# EAGLE design Adapterplatine (EAGLE 9.6.2)
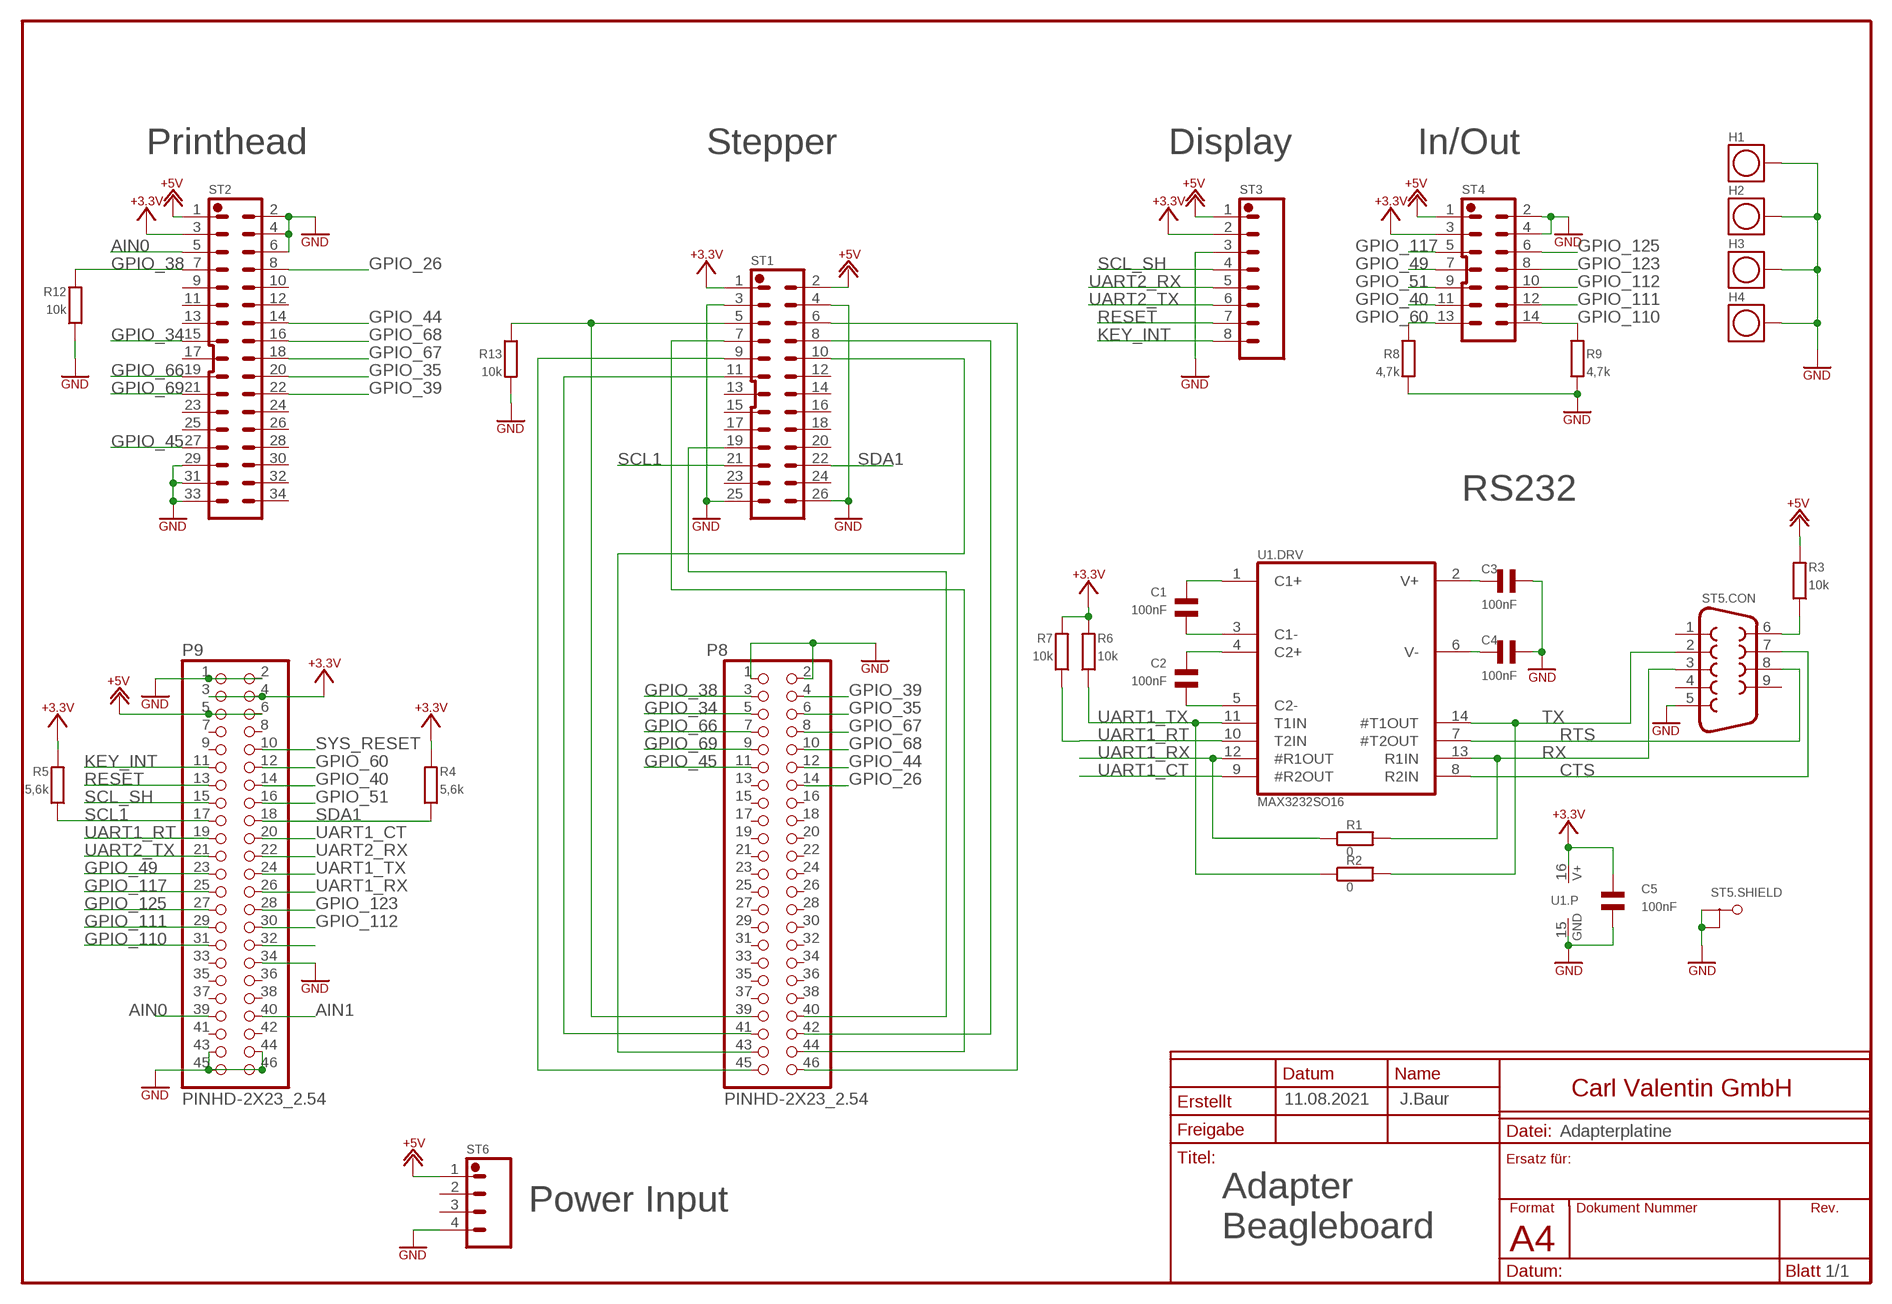
[diagram p0: schematic, sheet 1]

## Parts
C1  100nF  C0603L  [0603L]
C2  100nF  C0603L  [0603L]
C3  100nF  C0603L  [0603L]
C4  100nF  C0603L  [0603L]
C5  100nF  C0603L  [0603L]
H1  HALTERUNG_SQUAREHALTERUNG_SQUARE_6.5_3.5  [HALTERUNG_SQUARE_6.5_3.5]
H2  HALTERUNG_SQUAREHALTERUNG_SQUARE_6.5_3.5  [HALTERUNG_SQUARE_6.5_3.5]
H3  HALTERUNG_SQUAREHALTERUNG_SQUARE_6.5_3.5  [HALTERUNG_SQUARE_6.5_3.5]
H4  HALTERUNG_SQUAREHALTERUNG_SQUARE_6.5_3.5  [HALTERUNG_SQUARE_6.5_3.5]
P8  PINHD-2X23_2.54  [2X23]
P9  PINHD-2X23_2.54  [2X23]
R1  0  R0603L  [0603L]
R2  0  R0603L  [0603L]
R3  10k  R0603L  [0603L]
R4  5,6k  R0603L  [0603L]
R5  5,6k  R0603L  [0603L]
R6  10k  R0603L  [0603L]
R7  10k  R0603L  [0603L]
R8  4,7k  R0603L  [0603L]
R9  4,7k  R0603L  [0603L]
R12  10k  R0603L  [0603L]
R13  10k  R0603L  [0603L]
ST1  STK-26-2RJST-PHD_26_TH  [JST-PHD_26_TH]
ST2  STK-34-2R-MJST-PHD_34_TH-D1.0  [JST-PHD_34_TH-D1.0]
ST3  STK-08-1RJST-PH_8_TH  [JST-PH_8_TH]
ST4  STK-14-2RJST-PHD_14_TH  [JST-PHD_14_TH]
ST5  STK-09-SUBD-FSTK-09-SUBD-F-WSI  [STK-09-SUBD-F-WSI]
ST6  STK-04-1RJST-VH_4_TH  [JST-VH_4_TH]
U1  MAX3232SO16  [SO16]

## Nets
+3.3V: C5.P$2 P9.3 P9.4 R4.P$2 R5.P$2 R6.P$2 R7.P$2 ST1.1 ST2.3 ST3.2 ST4.3 U1.16(.P:V+)
+5V: P9.5 P9.6 R3.P$2 ST1.2 ST2.1 ST3.1 ST4.1 ST6.1
AIN0: P9.39 ST2.5
AIN1: P9.40
CTS: ST5.7 U1.8(.DRV:R2IN)
GND: C3.P$1 C4.P$2 C5.P$1 H1.P$1 H2.P$1 H3.P$1 H4.P$1 P8.1 P8.2 P9.1 P9.2 P9.34 P9.43 P9.44 P9.45 P9.46 R8.P$1 R9.P$1 R12.P$1 R13.P$2 ST1.3 ST1.4 ST1.25 ST1.26 ST2.2 ST2.4 ST2.6 ST2.29 ST2.31 ST2.33 ST3.3 ST4.2 ST4.4 ST5.5 ST5.G1(.SHIELD:S1) ST5.G2(.SHIELD:S2) ST6.4 U1.15(.P:GND)
GPIO_26: P8.14 ST2.8
GPIO_34: P8.5 ST2.15
GPIO_35: P8.6 ST2.20
GPIO_38: P8.3 R12.P$2 ST2.7
GPIO_39: P8.4 ST2.22
GPIO_40: P9.14 ST4.11
GPIO_44: P8.12 ST2.14
GPIO_45: P8.11 ST2.27
GPIO_49: P9.23 ST4.7
GPIO_51: P9.16 ST4.9
GPIO_60: P9.12 R8.P$2 ST4.13
GPIO_66: P8.7 ST2.19
GPIO_67: P8.8 ST2.18
GPIO_68: P8.10 ST2.16
GPIO_69: P8.9 ST2.21
GPIO_110: P9.31 R9.P$2 ST4.14
GPIO_111: P9.29 ST4.12
GPIO_112: P9.30 ST4.10
GPIO_117: P9.25 ST4.5
GPIO_123: P9.28 ST4.8
GPIO_125: P9.27 ST4.6
KEY_INT: P9.11 ST3.8
N$1: P8.46 ST1.6
N$2: P8.44 ST1.7
N$3: P8.42 ST1.8
N$4: P8.45 ST1.9
N$5: P8.43 ST1.10
N$6: P8.41 ST1.11
N$7: P8.39 R13.P$1 ST1.5
N$8: P8.40 ST1.19
N$9: P9.32
N$10: R3.P$1 ST5.6
N$21: C3.P$2 U1.2(.DRV:V+)
N$22: C4.P$1 U1.6(.DRV:V-)
N$23: C1.P$2 U1.1(.DRV:C1+)
N$24: C1.P$1 U1.3(.DRV:C1-)
N$25: C2.P$2 U1.4(.DRV:C2+)
N$26: C2.P$1 U1.5(.DRV:C2-)
RESET: P9.13 ST3.7
RTS: ST5.8 U1.7(.DRV:#T2OUT)
RX: R1.P$2 ST5.3 U1.13(.DRV:R1IN)
SCL1: P9.17 R5.P$1 ST1.21
SCL_SH: P9.15 ST3.4
SDA1: P9.18 R4.P$1 ST1.22
SYS_RESET: P9.10
TX: R2.P$2 ST5.2 U1.14(.DRV:#T1OUT)
UART1_CT: P9.20 U1.9(.DRV:#R2OUT)
UART1_RT: P9.19 R7.P$1 U1.10(.DRV:T2IN)
UART1_RX: P9.26 R1.P$1 U1.12(.DRV:#R1OUT)
UART1_TX: P9.24 R2.P$1 R6.P$1 U1.11(.DRV:T1IN)
UART2_RX: P9.22 ST3.5
UART2_TX: P9.21 ST3.6
Unconnected: P8.13 P8.15 P8.16 P8.17 P8.18 P8.19 P8.20 P8.21 P8.22 P8.23 P8.24 P8.25 P8.26 P8.27 P8.28 P8.29 P8.30 P8.31 P8.32 P8.33 P8.34 P8.35 P8.36 P8.37 P8.38 P9.7 P9.8 P9.9 P9.33 P9.35 P9.36 P9.37 P9.38 P9.41 P9.42 ST1.12 ST1.13 ST1.14 ST1.15 ST1.16 ST1.17 ST1.18 ST1.20 ST1.23 ST1.24 ST2.9 ST2.10 ST2.11 ST2.12 ST2.13 ST2.17 ST2.23 ST2.24 ST2.25 ST2.26 ST2.28 ST2.30 ST2.32 ST2.34 ST5.1 ST5.4 ST5.9 ST6.2 ST6.3

## Notes on the sheet
- Printhead | Stepper | Display | In/Out
- RS232
- 11.08.2021 | J.Baur
- Power Input
- Adapter
  Beagleboard

## Library data of the parts
C1-C5 = CV_Std:C
H1-H4 = CV_Board:HALTERUNG_SQUARE: Board-Befestigung; STUECKLISTE: 0
P8 P9 = pinhead-2:PINHD-2X23: PIN HEADER
R1-R9 R12 R13 = CV_Std:R
ST1 = CV_Con:STK-26-2R
ST2 = CV_Con:STK-34-2R-M
ST3 = CV_Con:STK-08-1R
ST4 = CV_Con:STK-14-2R
ST5 = CV_Con:STK-09-SUBD-F: Sub-D Female
ST6 = CV_Con:STK-04-1R
U1 = CV_Logic:MAX3232

## Board
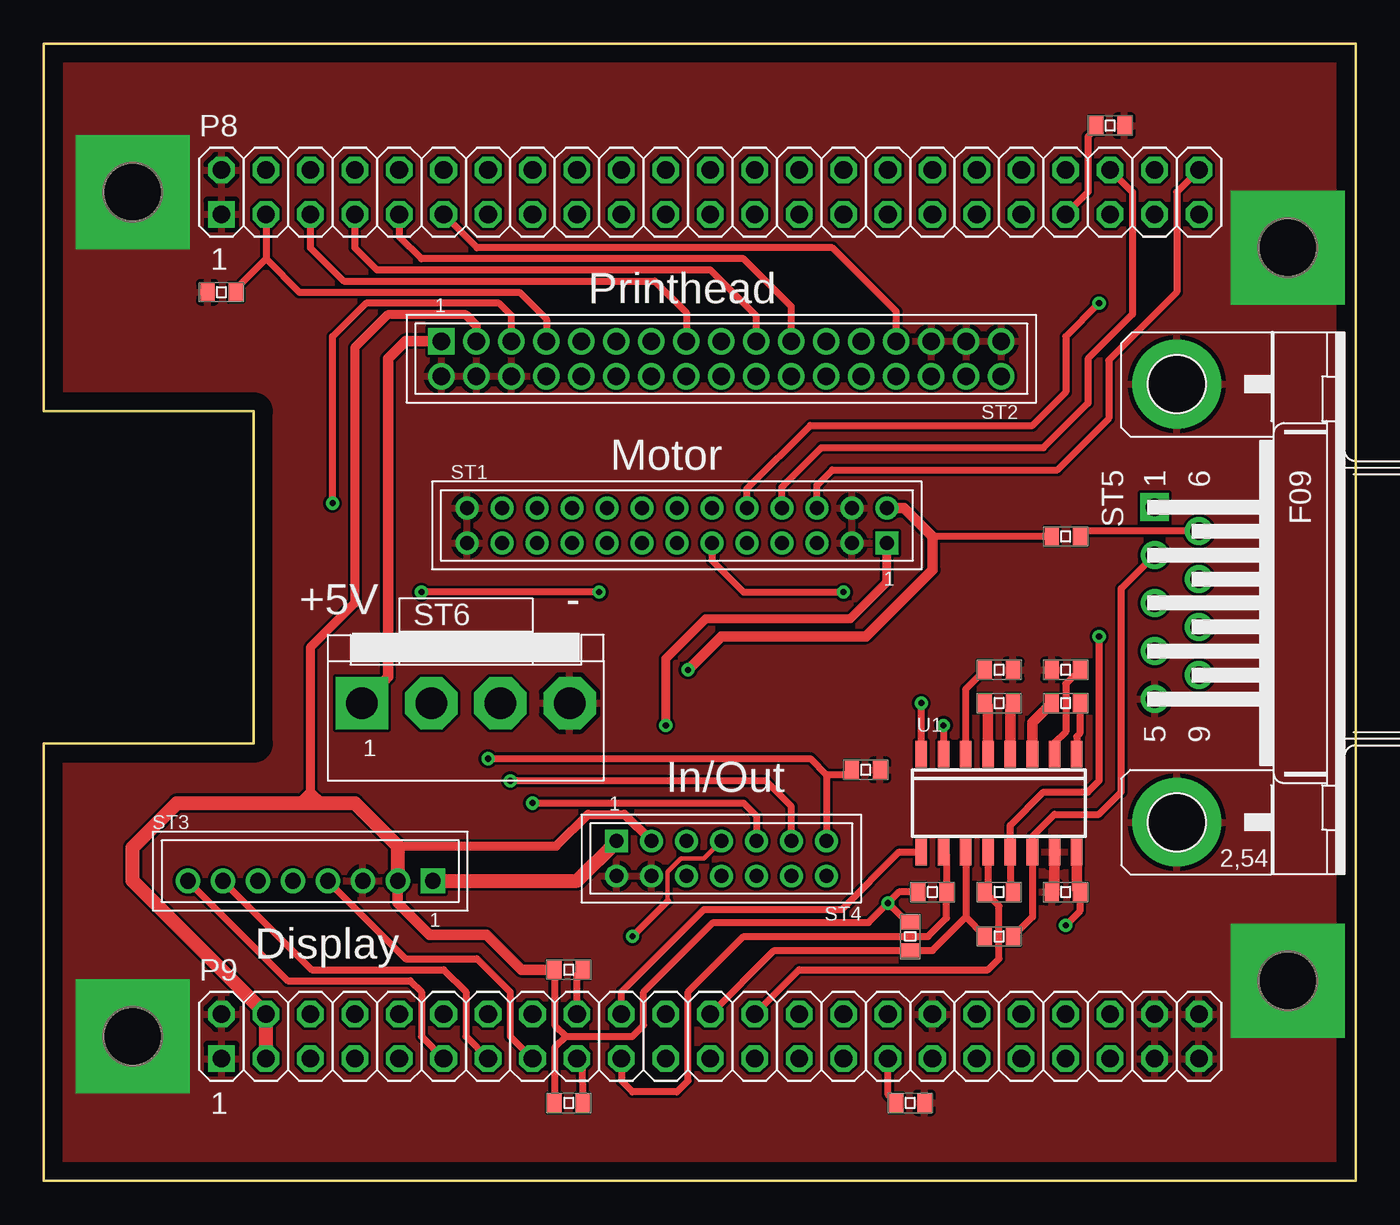
[diagram p1: board, top side]
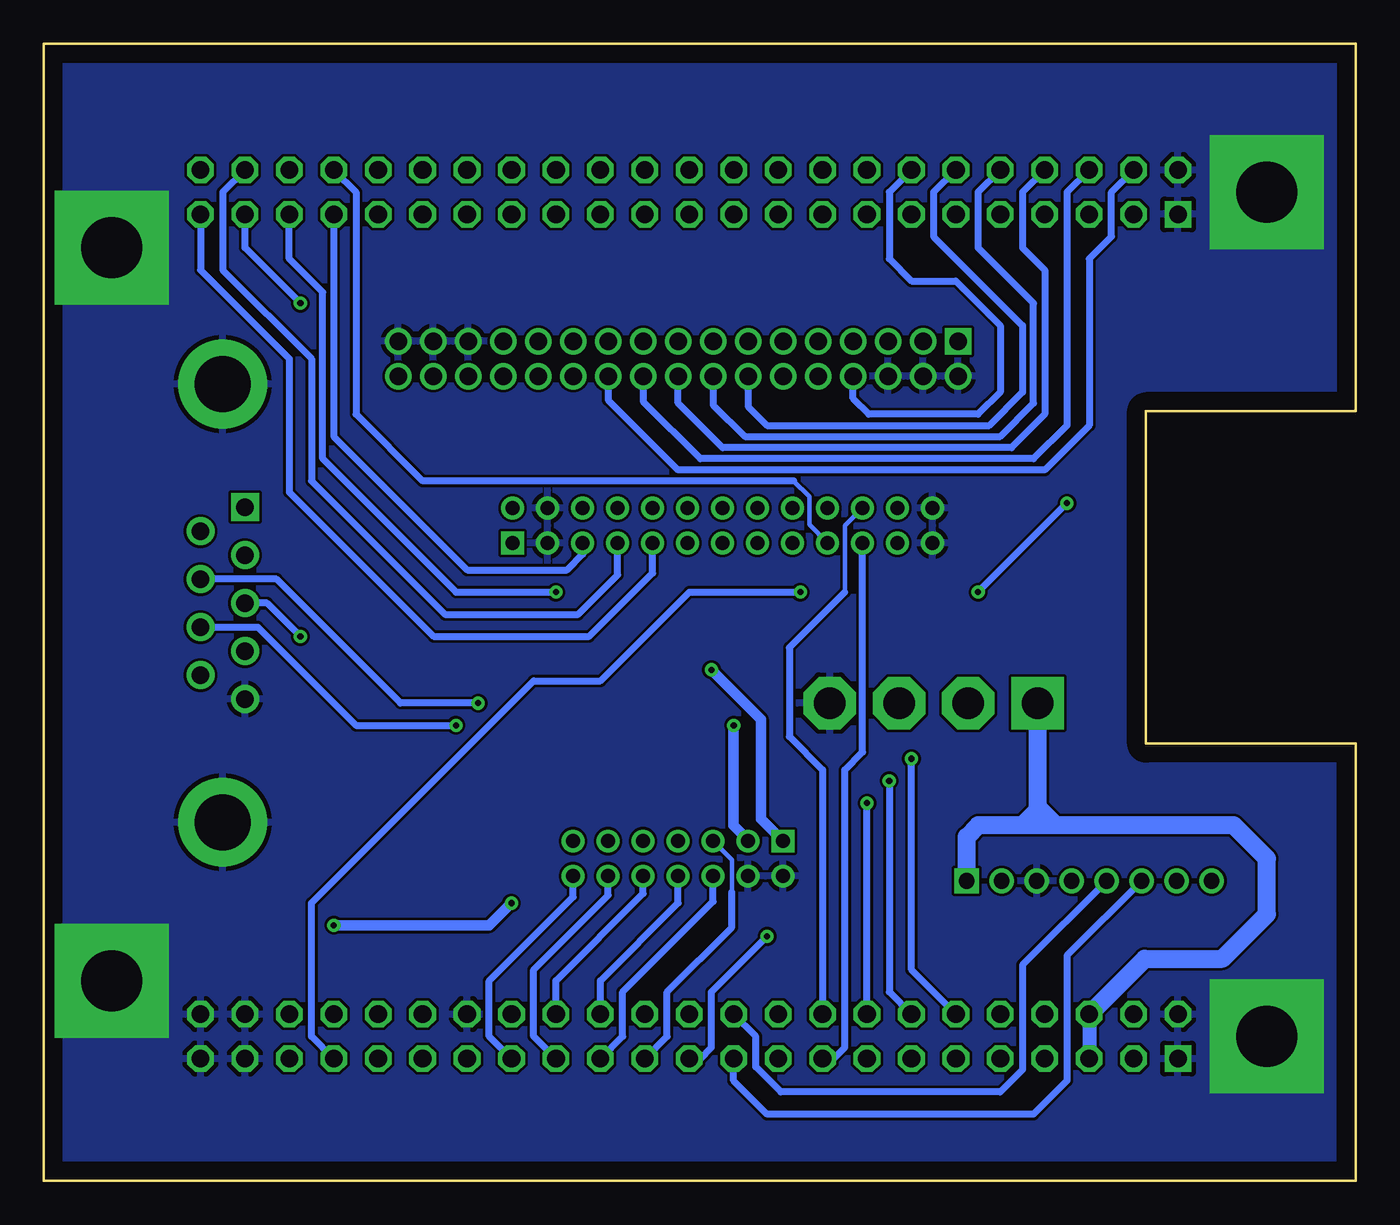
[diagram p2: board, bottom side, seen from below]

Size 75 x 65 mm. Coordinates in mm from the lower left corner, seen from the top.
Outline: 0,0 75,0 75,65 0,65 0,44 12,44 12,25 0,25 0,0
Copper layers (1*16): Top 0.035mm / dielectric 1.5mm / Bottom 0.035mm
Design rules "default *": minimum track width 6mil, minimum drill 0.35mm, track to track 6mil, track to pad 6mil, pad to pad 6mil, via to via 6mil, smd to smd 6mil, copper to edge 40mil, drill to drill 6mil, minimum pad ring 10mil, minimum via ring 8mil, stop-mask expansion 4mil, vias tented up to drill 0mil, thermal gap 10mil

### Footprints (pad centres in the part's own frame; a part is rotated, then mirrored left to right if it is on the bottom)
0603L = smd 0.8 x 1: P$1 -0.8,0; P$2 0.8,0
HALTERUNG_SQUARE_6.5_3.5 = drill 3.5 pad 6.5 square: P$1 0,0
2X23 = drill 1.016 square: 1 -25.4,-1.27 | drill 1.016 octagon: 2 -25.4,1.27; 3 -22.86,-1.27; 4 -22.86,1.27; 5 -20.32,-1.27; 6 -20.32,1.27; 7 -17.78,-1.27; 8 -17.78,1.27; 9 -15.24,-1.27; 10 -15.24,1.27; 11 -12.7,-1.27; 12 -12.7,1.27; 13 -10.16,-1.27; 14 -10.16,1.27; 15 -7.62,-1.27; 16 -7.62,1.27; 17 -5.08,-1.27; 18 -5.08,1.27; 19 -2.54,-1.27; 20 -2.54,1.27; 21 0,-1.27; 22 0,1.27; 23 2.54,-1.27; 24 2.54,1.27; 25 5.08,-1.27; 26 5.08,1.27; 27 7.62,-1.27; 28 7.62,1.27; 29 10.16,-1.27; 30 10.16,1.27; 31 12.7,-1.27; 32 12.7,1.27; 33 15.24,-1.27; 34 15.24,1.27; 35 17.78,-1.27; 36 17.78,1.27; 37 20.32,-1.27; 38 20.32,1.27; 39 22.86,-1.27; 40 22.86,1.27; 41 25.4,-1.27; 42 25.4,1.27; 43 27.94,-1.27; 44 27.94,1.27; 45 30.48,-1.27; 46 30.48,1.27
JST-PHD_26_TH = drill 0.8 square: 1 12,-1 | drill 0.8: 2 12,1; 3 10,-1; 4 10,1; 5 8,-1; 6 8,1; 7 6,-1; 8 6,1; 9 4,-1; 10 4,1; 11 2,-1; 12 2,1; 13 0,-1; 14 0,1; 15 -2,-1; 16 -2,1; 17 -4,-1; 18 -4,1; 19 -6,-1; 20 -6,1; 21 -8,-1; 22 -8,1; 23 -10,-1; 24 -10,1; 25 -12,-1; 26 -12,1
JST-PHD_34_TH-D1.0 = drill 1 square: 1 16,-1 | drill 1: 2 16,1; 3 14,-1; 4 14,1; 5 12,-1; 6 12,1; 7 10,-1; 8 10,1; 9 8,-1; 10 8,1; 11 6,-1; 12 6,1; 13 4,-1; 14 4,1; 15 2,-1; 16 2,1; 17 0,-1; 18 0,1; 19 -2,-1; 20 -2,1; 21 -4,-1; 22 -4,1; 23 -6,-1; 24 -6,1; 25 -8,-1; 26 -8,1; 27 -10,-1; 28 -10,1; 29 -12,-1; 30 -12,1; 31 -14,-1; 32 -14,1; 33 -16,-1; 34 -16,1
JST-PH_8_TH = drill 0.9 square: 1 7,0 | drill 0.9: 2 5,0; 3 3,0; 4 1,0; 5 -1,0; 6 -3,0; 7 -5,0; 8 -7,0
JST-PHD_14_TH = drill 0.8 square: 1 6,-1 | drill 0.8: 2 6,1; 3 4,-1; 4 4,1; 5 2,-1; 6 2,1; 7 0,-1; 8 0,1; 9 -2,-1; 10 -2,1; 11 -4,-1; 12 -4,1; 13 -6,-1; 14 -6,1
STK-09-SUBD-F-WSI = drill 1 pad 1.6 square: 1 -5.486,-1.27 | drill 1 pad 1.6: 2 -2.743,-1.27; 3 0,-1.27; 4 2.743,-1.27; 5 5.486,-1.27; 6 -4.115,1.27; 7 -1.372,1.27; 8 1.372,1.27; 9 4.115,1.27 | drill 3.2 pad 5.08: G1 -12.522,0; G2 12.522,0
JST-VH_4_TH = drill 1.8 pad 3 square: 1 -5.94,0 | drill 1.8 pad 3 octagon: 2 -1.98,0; 3 1.98,0; 4 5.94,0
SO16 = smd 0.66 x 1.524: 1 -4.445,-2.803; 2 -3.175,-2.803; 3 -1.905,-2.803; 4 -0.635,-2.803; 5 0.635,-2.803; 6 1.905,-2.803; 7 3.175,-2.803; 8 4.445,-2.803; 9 4.445,2.803; 10 3.175,2.803; 11 1.905,2.803; 12 0.635,2.803; 13 -0.635,2.803; 14 -1.905,2.803; 15 -3.175,2.803; 16 -4.445,2.803

### Placement (x,y rotation side)
C1  58.42,27.3 0 top
C2  54.61,27.3 0 top
C3  58.42,29.21 0 top
C4  54.61,29.21 0 top
C5  58.42,16.51 0 top
H1  5.08,56.52 0 top
H2  71.12,53.34 0 top
H3  71.12,11.43 0 top
H4  5.08,8.26 0 top
P8  35.56,56.52 0 top
P9  35.56,8.26 0 top
R1  54.61,16.51 0 top
R2  54.61,13.97 0 top
R3  58.42,36.83 180 top
R4  30.01,12.06 180 top
R5  30.01,4.45 180 top
R6  49.53,13.97 90 top
R7  50.8,16.51 180 top
R8  46.99,23.5 180 top
R9  49.53,4.45 180 top
R12  10.16,50.8 0 top
R13  60.96,60.33 0 top
ST1  36.2,37.47 0 top
ST2  38.73,46.99 180 top
ST3  15.24,17.14 0 top
ST4  38.73,18.41 180 top
ST5  64.77,33.02 270 top
ST6  24.13,27.3 0 top
U1  54.61,21.59 180 top

### Tracks (layer width: path | path; a pad name or v marks a point on that pad's centre or on a via)
+3.3V  (via drill 0.35)
  Top 0.406: R4.P$2 29.21,8.89 29.84,8.26 | 29.84,8.26 29.21,7.62 R5.P$2 | 29.84,8.26 33.66,8.26 34.29,8.89 34.29,10.79 38.27,14.77 47.16,14.77 v48.26,15.88 | C5.P$2 59.22,15.4 v58.42,14.61 | v48.26,15.88 48.9,16.51 R7.P$2 | R6.P$2 49.37,14.77 v48.26,15.88
  Top 0.508: ST2.3 24.73,48.9 24.13,49.51 19.66,49.51 17.78,47.62 17.78,33.02 15.24,30.48 15.24,22.23 | 15.88,21.59 15.24,22.23 | 15.24,22.23 14.61,21.59 | 20.24,19.13 29.29,19.13 31.11,20.95 33.2,20.95 ST4.3 | v35.56,26.04 35.56,29.84 37.85,32.13 46.1,32.13 48.2,34.23 ST1.1
  Top 0.61: C5.P$2 59.05,16.68 U1.16 | ST3.2 20.24,15.88 22.07,14.05 25.32,14.05 27.3,12.06 R4.P$2
  Top 0.813: P9.3 P9.4 5.08,17.14 5.08,19.05 7.62,21.59 14.61,21.59 15.88,21.59 17.78,21.59 20.24,19.13 ST3.2
  Bottom 0.61: v58.42,14.61 49.53,14.61 v48.26,15.88 | ST4.3 34.73,19.5 35.56,20.32 v35.56,26.04
+5V  (via drill 0.35)
  Top 0.406: R3.P$2 50.8,36.83
  Top 0.61: ST2.1 20.68,47.99 19.68,46.99 19.68,28.8 ST6.1 | v36.83,29.21 38.73,31.11 46.99,31.11 50.8,34.92 50.8,36.83 49.16,38.47 ST1.2
  Top 0.813: ST4.1 32.73,19.39 30.5,17.14 ST3.1
  Bottom 0.61: ST4.1 34.01,20.68 34.01,26.39 v36.83,29.21
  Bottom 0.813: 18.19,21.18 18,21.18 | P9.6 P9.5
  Bottom 1.016: P9.6 12.06,12.7 7.62,12.7 5.08,15.24 5.08,18.41 6.99,20.32 17.14,20.32 | ST3.1 22.24,19.67 21.59,20.32 19.05,20.32 | 17.14,20.32 19.05,20.32 | ST6.1 18.19,21.18 19.05,20.32 | 18,21.18 17.14,20.32
AIN0  (via drill 0.35)
  Top 0.406: ST2.5 26.73,49.47 26.04,50.16 18.41,50.16 16.51,48.26 v16.51,38.73 | v31.75,33.66 v21.59,33.66
  Bottom 0.406: P9.39 59.69,8.26 59.69,15.88 46.99,28.57 43.18,28.57 38.1,33.66 v31.75,33.66 | v21.59,33.66 v16.51,38.73
CTS  (via drill 0.35)
  Top 0.406: U1.8 v50.16,27.3
  Bottom 0.406: ST5.7 61.7,34.39 54.61,27.3 v50.16,27.3
GND
  Top 0.61: U1.15 57.78,16.68 C5.P$1
  pour Top: -1.91,65.41 -1.91,-1.27 76.2,-1.27 76.2,65.41
  pour Bottom: -0.64,65.41 -0.64,-1.27 76.2,-1.27 76.2,65.41
GPIO_26
  Bottom 0.406: P8.14 26.67,56.52 26.67,52.7 25.4,51.44 22.86,51.44 20.32,48.9 20.32,45.09 21.59,43.81 27.83,43.81 28.73,44.72 ST2.8
GPIO_34
  Top 0.406: P8.5 15.24,53.34 17.14,51.44 34.92,51.44 36.73,49.62 ST2.15
GPIO_35
  Bottom 0.406: P8.6 16.51,56.52 16.51,43.18 18.41,41.27 37.47,41.27 40.73,44.55 ST2.20
GPIO_38
  Top 0.406: P8.3 12.7,52.7 | ST2.7 28.73,49.26 27.2,50.8 14.61,50.8 12.7,52.7 | R12.P$2 10.96,50.97 12.7,52.7
GPIO_39
  Bottom 0.406: ST2.22 42.73,44.64 38.73,40.64 17.78,40.64 15.24,43.18 15.24,52.7 13.97,53.98 13.97,56.52 P8.4
GPIO_40  (via drill 0.35)
  Top 0.406: ST4.11 42.73,21.4 41.27,22.86 40.01,22.86 v26.67,22.86
  Bottom 0.406: v26.67,22.86 26.67,10.79 P9.14
GPIO_44
  Bottom 0.406: P8.12 24.13,56.52 24.13,53.98 19.05,48.9 19.05,45.09 20.95,43.18 33.66,43.18 34.73,44.26 ST2.14
GPIO_45
  Top 0.406: P8.11 24.77,53.34 45.09,53.34 48.73,49.69 ST2.27
GPIO_49  (via drill 0.35)
  Top 0.254: ST4.7 37.73,18.41 36.41,18.41 35.67,17.67 35.67,15.98
  Top 0.406: v33.66,13.97 35.56,15.88 35.67,15.98
  Bottom 0.406: P9.23 37.47,6.99 36.83,7.62 36.83,10.79 v33.66,13.97
GPIO_51  (via drill 0.35)
  Top 0.406: v27.94,21.59 40.01,21.59 40.73,20.86 ST4.9
  Bottom 0.406: P9.16 v27.94,21.59
GPIO_60  (via drill 0.35)
  Top 0.406: v25.4,24.13 43.81,24.13 44.73,23.21 | 44.73,23.21 ST4.13 | R8.P$2 45.91,23.21 45.09,23.21 | 45.09,23.21 44.73,23.21 | 45.09,23.21
  Bottom 0.406: P9.12 25.4,12.06 v25.4,24.13
GPIO_66
  Top 0.406: P8.7 17.78,53.34 19.05,52.07 38.1,52.07 40.73,49.44 ST2.19
GPIO_67
  Bottom 0.406: ST2.18 38.73,44.45 36.2,41.91 19.68,41.91 17.78,43.81 17.78,52.07 19.05,53.34 19.05,56.52 P8.8
GPIO_68
  Bottom 0.406: ST2.16 36.73,44.35 34.92,42.55 20.32,42.55 18.41,44.45 18.41,50.16 21.59,53.34 21.59,56.52 P8.10
GPIO_69
  Top 0.406: P8.9 20.32,53.98 21.59,52.7 40.01,52.7 42.73,49.98 ST2.21
GPIO_110
  Top 0.406: R9.P$2 48.26,4.92 P9.31
  Bottom 0.406: P9.31 49.53,8.26 49.53,11.43 44.73,16.23 ST4.14
GPIO_111
  Bottom 0.406: P9.29 46.99,8.26 46.99,12.06 42.73,16.32 ST4.12
GPIO_112
  Bottom 0.406: P9.30 45.72,11.43 40.73,16.41 ST4.10
GPIO_117
  Bottom 0.254: ST4.5 35.67,18.35 35.67,16.51
  Bottom 0.406: P9.25 39.37,8.26 39.37,10.79 35.67,14.5 35.67,16.51
GPIO_123
  Bottom 0.406: P9.28 43.18,11.43 38.73,15.88 ST4.8
GPIO_125
  Bottom 0.406: P9.27 41.91,8.26 41.91,10.79 36.73,15.97 ST4.6
KEY_INT
  Top 0.406: ST3.8 13.96,11.43 20.95,11.43 21.59,10.79 21.59,8.26 P9.11
N$1
  Top 0.406: P8.46 64.77,56.52 64.77,50.8 60.88,46.91 60.88,43.58 57.94,40.64 45.09,40.64 44.2,39.75 ST1.6
N$2
  Bottom 0.406: P8.44 64.77,56.52 64.77,52.07 59.69,46.99 59.69,40.01 52.07,32.38 44.45,32.38 42.2,34.64 ST1.7
N$3
  Top 0.406: P8.42 62.23,56.52 62.23,49.53 59.69,46.99 59.69,44.45 57.15,41.91 44.45,41.91 42.2,39.66 ST1.8
N$4
  Bottom 0.406: P8.45 66.04,52.07 60.96,46.99 60.96,39.37 52.7,31.11 43.81,31.11 40.2,34.73 ST1.9
N$5  (via drill 0.35)
  Top 0.406: ST1.10 40.2,39.56 43.81,43.18 56.52,43.18 58.42,45.09 58.42,48.26 v60.33,50.16
  Bottom 0.406: v60.33,50.16 63.5,53.34 P8.43
N$6  (via drill 0.35)
  Top 0.406: ST1.11 38.2,35.47 40.01,33.66 v45.72,33.66
  Bottom 0.406: v45.72,33.66 51.44,33.66 59.05,41.27 59.05,50.8 60.96,52.7 P8.41
N$7
  Top 0.406: P8.39 59.69,56.52 59.69,59.69 60.16,60.16 R13.P$1
  Bottom 0.406: P8.39 58.42,42.55 50.8,34.92 45.09,34.92 44.2,35.81 ST1.5
N$8
  Bottom 0.254: ST1.19 31.24,37.51 31.24,39.12 32.13,40.01
  Bottom 0.406: P8.40 57.15,56.52 57.15,43.81 53.34,40.01 32.13,40.01
N$10
  Top 0.406: ST5.6 59.52,37.13 R3.P$1
N$21
  Top 0.406: U1.2 57.78,25.03 58.42,25.66 58.42,28.41 C3.P$2
N$22
  Top 0.406: U1.6 52.7,28.11 C4.P$1
N$23
  Top 0.406: C1.P$2 59.22,25.57 59.05,25.4 U1.1
N$24
  Top 0.61: U1.3 56.52,26.2 C1.P$1
N$25
  Top 0.61: U1.4 55.24,27.14 C2.P$2
N$26
  Top 0.61: U1.5 53.98,27.14 C2.P$1
RESET
  Top 0.406: P9.13 24.13,8.26 24.13,10.79 22.86,12.06 15.32,12.06 ST3.7
RTS  (via drill 0.35)
  Top 0.406: v51.44,26.04 U1.7
  Bottom 0.406: ST5.8 62.76,31.65 57.15,26.04 v51.44,26.04
RX  (via drill 0.35)
  Top 0.406: v60.33,31.11 60.33,22.86 59.69,22.23 57.15,22.23 55.24,20.32 U1.13 55.24,16.68 R1.P$2
  Bottom 0.406: v60.33,31.11 62.23,33.02 ST5.3
SCL1
  Top 0.406: P9.17 30.79,6.68 R5.P$1
  Bottom 0.406: P9.17 29.84,6.99 29.21,7.62 29.21,23.5 28.2,24.51 ST1.21
SCL_SH
  Top 0.406: P9.15 26.67,8.26 26.67,10.79 24.77,12.7 20.68,12.7 ST3.4
SDA1
  Top 0.406: P9.18 30.48,11.73 R4.P$1
  Bottom 0.254: ST1.22 29.21,37.45 29.21,33.66
  Bottom 0.406: 29.21,33.66 32.38,30.48 32.38,25.4 30.48,23.5 P9.18
TX
  Top 0.406: ST5.2 61.59,33.86 61.59,22.23 60.33,20.95 57.78,20.95 56.52,19.68 U1.14 56.52,15.07 R2.P$2
UART1_CT
  Top 0.406: P9.20 33.02,10.79 37.72,15.49 45.6,15.49 48.9,18.79 U1.9
UART1_RT
  Top 0.406: P9.19 33.02,5.71 33.66,5.08 36.2,5.08 36.83,5.71 36.83,10.79 40.01,13.97 50.55,13.97 51.6,15.02 R7.P$1 51.6,18.62 U1.10
UART1_RX
  Top 0.406: P9.26 43.18,12.06 53.98,12.06 54.61,12.7 54.61,15.71 R1.P$1 53.98,16.68 U1.12
UART1_TX
  Top 0.406: R2.P$1 52.7,15.07 | U1.11 52.7,15.07 | P9.24 41.74,13.17 R6.P$1 50.8,13.17 52.7,15.07
UART2_RX
  Bottom 0.406: P9.22 34.29,8.26 34.29,6.5 32.87,5.08 20.32,5.08 19.05,6.35 19.05,12.34 ST3.5
UART2_TX
  Bottom 0.406: P9.21 35.56,5.71 33.66,3.81 18.41,3.81 16.51,5.71 16.51,12.88 ST3.6

### Text on the board
tNames: 1 | Printhead | Motor | +5V | - | In/Out | Display | 1